# Altium schematic sheet power.SchDoc
size A4; SheetNumber: 2; SheetTotal: 4
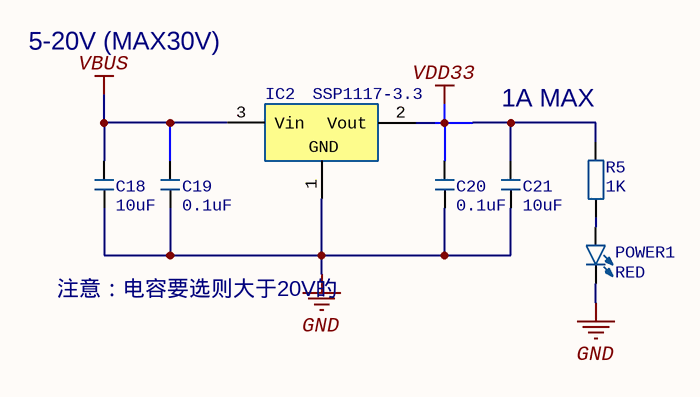
[diagram p0: power.SchDoc]

## Parts
C18  10uF  [C 0603_L]
C19  0.1uF  [C 0603_L]
C20  0.1uF  [C 0603_L]
C21  10uF  [C 0603_L]
IC2  SSP1117-3.3  [SOT223_N]
POWER1  RED  [LED 0603R]
R5  1K  [R 0603_L]

## Nets
GND: C18.1 C19.1 C20.1 C21.1 IC2.1(GND) POWER1.2(K)
VBUS: C18.2 C19.2 IC2.3(Vin)
VDD33: C20.2 C21.2 IC2.2(Vout) R5.2
NetPOWER1_1: POWER1.1(A) R5.1

## Notes on the sheet
- 5-20V (MAX30V)
- 1A MAX
- 注意：电容要选则大于20V的
- Title:
- A4
- Name:
- Date:
- Author@
- firestaradmin

## Library data of the parts
C18-C21 = C: 无极性贴片电容; 版权归属: 源创客; BOM名称: 无极性贴片电容; 学习资源: www.ooocke.com
IC2 = SSP1117-3.3: LDO 3.3V  1A  压差1.3V （x~20V  极限30V）
POWER1 = LED-SMD: 贴片LED; 版权归属: 源创客; BOM名称: 贴片LED; 学习资源: www.ooocke.com
R5 = R: 贴片电阻; 版权归属: 源创客; BOM名称: 贴片电阻; 学习资源: www.ooocke.com